# Altium schematic sheet STM32_Trans_sheet.SchDoc
size A; SheetNumber: 1; SheetTotal: 1
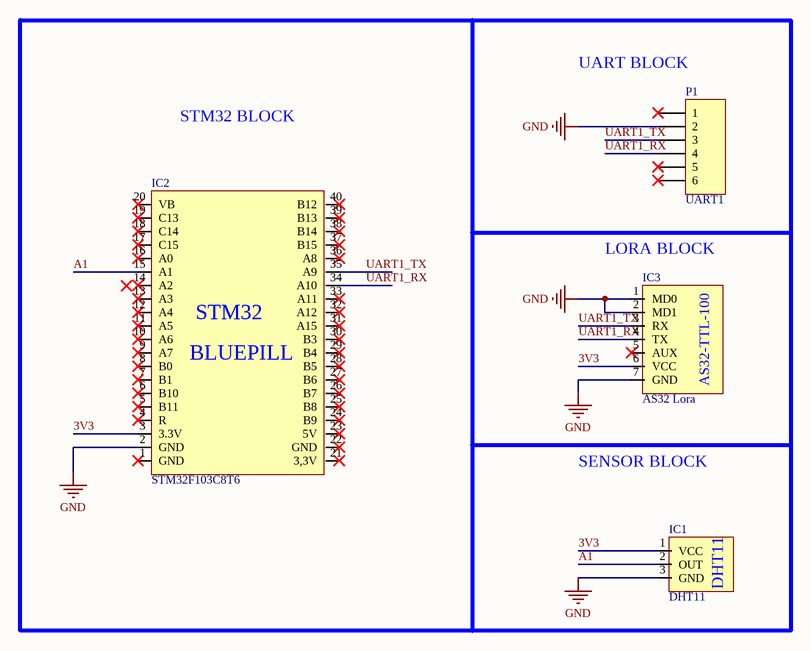
[diagram p0: STM32_Trans_sheet.SchDoc]

## Parts
IC1  DHT11  [DHT11]
IC2  STM32F103C8T6  [STM32_BLUEPILL]
IC3  AS32 Lora  [LORA]
P1  UART1  [HDR1X6]

## Nets
GND: IC1.3(GND) IC2.2(GND) IC3.1(MD0) IC3.2(MD1) IC3.7(GND) P1.2
3V3: IC1.1(VCC) IC2.3(3.3V) IC3.6(VCC)
A1: IC1.2(OUT) IC2.15(A1)
UART1_RX: IC2.34(A10) IC3.4(TX) P1.4
UART1_TX: IC2.35(A9) IC3.3(RX) P1.3

Not connected (* = marked no-connect by the designer): IC2 1(GND)* 4(R)* 5(B11)* 6(B10)* 7(B1)* 8(B0)* 9(A7)* 10(A6)* 11(A5)* 12(A4)* 13(A3)* 14(A2)* 16(A0)* 17(C15)* 18(C14)* 19(C13)* 20(VB)* 21(3,3V)* 22(GND)* 23(5V)* 24(B9)* 25(B8)* 26(B7)* 27(B6)* 28(B5)* 29(B4)* 30(B3)* 31(A15)* 32(A12)* 33(A11)* 36(A8)* 37(B15)* 38(B14)* 39(B13)* 40(B12)*; IC3 5(AUX)*; P1 1* 5* 6*

## Notes on the sheet
- (near P1) UART BLOCK
- STM32 BLOCK
- LORA BLOCK
- SENSOR BLOCK
- (in symbol LORA) AS32-TTL-100
- (in symbol STM32_BLUEPILL) STM32; BLUEPILL

## Library data of the parts
IC2 = STM32_BLUEPILL
IC3 = LORA
P1 = Header 6: Header, 6-Pin; LatestRevisionDate: 17-Jul-2002; LatestRevisionNote: Re-released for DXP Platform.; Publisher: Altium Limited